# Altium schematic sheet SH10 - USB.SchDoc: Power Distribution Board Rev2 - USB
size Letter; DrawnBy: Cindy Li; Organization: UW Robotics; Address1: 200 University Avenue; Address2: Waterloo; Address3: Ontario; Address4: Canada N2L 3G6; DocumentNumber: 10; SheetNumber: 10; SheetTotal: 12
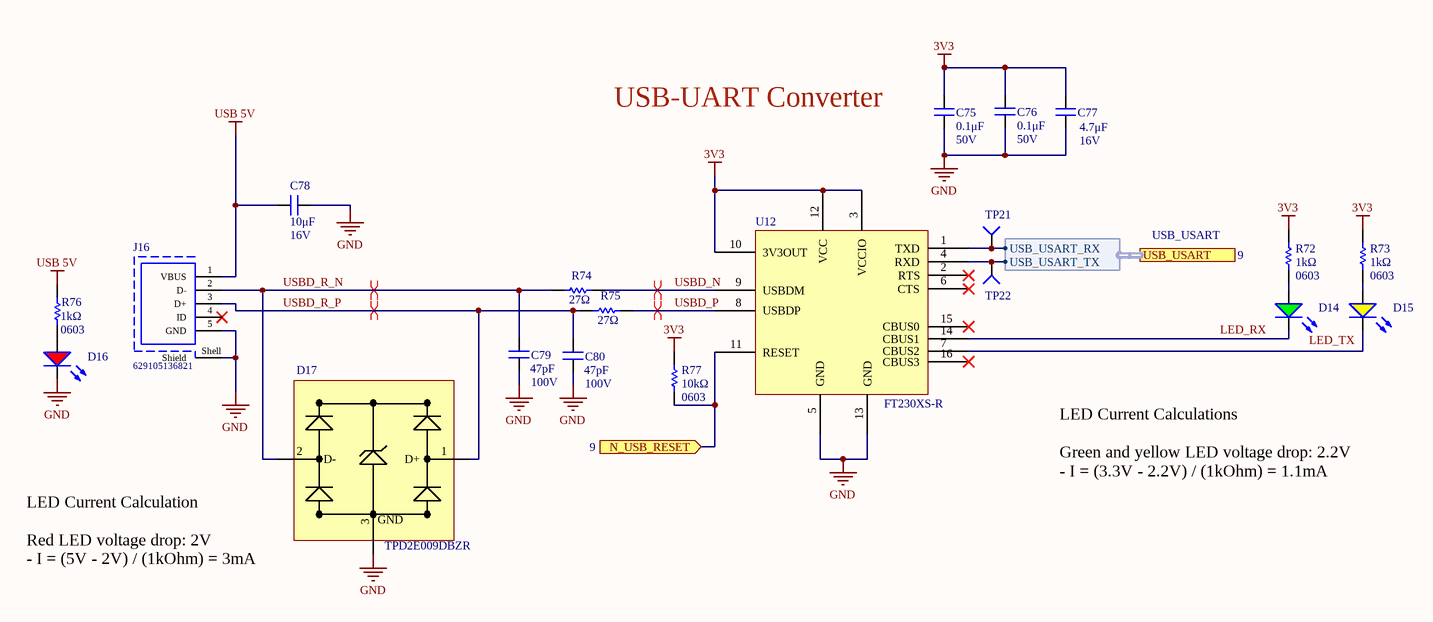
[diagram p0: SH10 - USB.SchDoc]

## Parts
C75  Voltage Rating: 50V  [CAP2012]  (hidden comment: 0.1μF)
C76  Voltage Rating: 50V  [CAP2012]  (hidden comment: 0.1μF)
C77  value 4.7μF  Voltage Rating: 16V  [CAP0603]  (hidden comment: CAP_4.7uF_16V_0603)
C78  value 10μF  Voltage Rating: 16V  [CAP0603]  (hidden comment: CAP_10nF_0603)
C79  value 47pF  Voltage Rating: 100V  [CAP0603]  (hidden comment: CAP_47pF_100V_0603)
C80  value 47pF  Voltage Rating: 100V  [CAP0603]  (hidden comment: CAP_47pF_100V_0603)
D14  LG R971-KN-1  [LED_0805_GREEN]  (value not drawn)
D15  LY R976-PS-36  [LED_0805_YELLOW]  (value not drawn)
D16  LS R976-NR-1  [LED_0805_RED]  (value not drawn)
D17  Manufacturer Part Number: TPD2E009DBZR  [SOT23-3]  (hidden comment: TVS_DIODE_USB_5.5V)
J16  629105136821  [629105136821]
R72  value 1kΩ  Case Code (Imperial): 0603  [RESC0603(1608)_N]  (hidden comment: RES_1kΩ_0603)
R73  value 1kΩ  Case Code (Imperial): 0603  [RESC0603(1608)_N]  (hidden comment: RES_1kΩ_0603)
R74  Resistance: 27Ω  [RESC0603(1608)_N]  (hidden comment: RES_27Ω_0603)
R75  Resistance: 27Ω  [RESC0603(1608)_N]  (hidden comment: RES_27Ω_0603)
R76  value 1kΩ  Case Code (Imperial): 0603  [RESC0603(1608)_N]  (hidden comment: RES_1kΩ_0603)
R77  value 10kΩ  Case Code (Imperial): 0603  [RESC0603(1608)_N]  (hidden comment: RES_10kΩ_0603)
TP21  TESTPOINT_SMD_LOOP  [S1751-46R]  (value not drawn)
TP22  TESTPOINT_SMD_LOOP  [S1751-46R]  (value not drawn)
U12  Manufacturer Part Number 1: FT230XS-R  [SSOP16-0.635-5X4MM]  (hidden comment: IC_USB_TRANSCEIVER)

## Ports
N_USB_RESET (in, see 9), USB_USART (harness USB_USART, see 9)

## Harnesses
USB_USART: USB_USART_RX, USB_USART_TX

## Nets
3V3: C75.2 C76.2 C77.1 R72.2 R73.2 R77.2 U12.3(VCCIO) U12.10(3V3OUT) U12.12(VCC)
GND: C75.1 C76.1 C77.2 C78.2 C79.1 C80.2 D16.2(K) D17.3(GND) J16.5(GND) J16.Shell(Shield) U12.5(GND) U12.13(GND)
USB 5V: C78.1 J16.1(VBUS) R76.2
N_USB_RESET: R77.1 U12.11(RESET) ; port N_USB_RESET
USBD_N: R74.2 U12.9(USBDM)
USBD_P: R75.2 U12.8(USBDP)
USBD_R_N: C79.2 D17.2(D-) J16.2(D-) R74.1
USBD_R_P: C80.1 D17.1(D+) J16.3(D+) R75.1
NetD14_1: D14.1(A) R72.1
NetD14_2: D14.2(K) U12.14(CBUS1)
NetD15_1: D15.1(A) R73.1
NetD15_2: D15.2(K) U12.7(CBUS2)
NetD16_1: D16.1(A) R76.1
NetTP21_1: TP21.1(=value) U12.1(TXD) ; port USB_USART.USB_USART_RX
NetTP22_1: TP22.1(=value) U12.4(RXD) ; port USB_USART.USB_USART_TX

Not connected (* = marked no-connect by the designer): J16 4(ID)*; U12 2(RTS)* 6(CTS)* 15(CBUS0)* 16(CBUS3)*

## Layout directives
differential pair: USBD_N, USBD_P, USBD_R_N, USBD_R_P

## Notes on the sheet
- USB-UART Converter
- LED Current Calculations
  Green and yellow LED voltage drop: 2.2V
  - I = (3.3V - 2.2V) / (1kOhm) = 1.1mA
- (near D17) LED Current Calculation
  Red LED voltage drop: 2V
  - I = (5V - 2V) / (1kOhm) = 3mA
- Labels drawn without touching a wire or pin: LED_RX, LED_TX
- Title
- Size:
- Date:
- Letter
- Drawn By:
- Sheet
- of
- File:

## Library data of the parts
C75 C76 = CAP_0.1uF_50V_0805: CAP CER 0.1UF 50V X7R 0805; Manufacturer 1: Murata Electronics; Manufacturer Part Number 1: GCD21BR71H104KA01L; Tolerance: 10%; Mount: Surface Mount; Case Code (Metric): 2012; Case Code (Imperial): 0805; Min Operating Temperature: -55°C; Max Operating Temperature: 125°C; Dielectric: X7R; Termination: SMD/SMT; Length: 2mm; Height: 1.25mm; Width: 0.049inch; Thickness: 0.049inch; Depth: 1.25mm; Ratings: AEC-Q200; Supplier 1: Digi-Key; Supplier Part Number 1: 490-11955-1-ND; Value: 0.1μF; Package: 0805 (2012 Metric)
C77 = CAP_4.7uF_16V_0603: CAP CER 4.7UF 16V X6S 0603; Manufacturer Part Number 1: GRM188C81C475KE11D; Manufacturer 1: Murata Electronics; Package: 0603 (1608 Metric); Supplier Part Number 1: 490-13362-1-ND; Supplier 1: Digi-Key; Mount: Surface Mount; Case Code (Imperial): 0603; Dielectric: X6S
C78 = CAP_10nF_0603: CAP CER 10000PF 16V X7R 0603; Manufacturer Part Number 1: CC0603KRX7R7BB103; Manufacturer 1: Yageo; Dimensions: 0.063" L x 0.031" W (1.60mm x 0.80mm); Package: 0603 (1608 Metric); Temperature Coefficient: X7R; Supplier Part Number 1: 311-3369-1-ND; Supplier 1: Digi-Key; Mount: Surface Mount; Case Code (Imperial): 0603; Case Code (Metric): 1608; Dielectric: X7R
C79 C80 = CAP_47pF_100V_0603: CAP CER 47PF 100V C0G/NP0 0603; Manufacturer Part Number 1: C0603C470J1GACTU; Manufacturer 1: KEMET; Temperature Coefficient: C0G; Dielectric: C0G, NP0; Dimensions: 0.063" L x 0.031" W (1.60mm x 0.80mm); Package: 0603 (1608 Metric); Supplier Part Number 1: 399-7917-1-ND; Supplier 1: Digi-Key; Mount: Surface Mount; Case Code (Imperial): 0603; Case Code (Metric): 1608
D14 = DIO_LED_G: LED GREEN DIFFUSED 0805 SMD; Manufacturer 1: OSRAM; Forward Voltage Drop: 2.2V; Package: 0805 (2012 Metric); Manufacturer Part Number 1: LG R971-KN-1; Supplier Part Number 1: 475-1410-1-ND; Supplier 1: Digi-Key; Mount: Surface Mount
D15 = DIO_LED_Y: LED YELLOW DIFFUSED 0805 SMD; Manufacturer 1: OSRAM; Forward Voltage Drop: 2.2V; Package: 0805 (2012 Metric); Manufacturer Part Number 1: LY R976-PS-36; Supplier Part Number 1: 475-2560-1-ND; Supplier 1: Digi-Key; Mount: Surface Mount
D16 = DIO_LED_R: LED RED DIFFUSED 0805 SMD; Manufacturer 1: OSRAM; Forward Voltage Drop: 2V; Package: 0805 (2012 Metric); Manufacturer Part Number 1: LS R976-NR-1; Supplier Part Number 1: 475-1278-1-ND; Supplier 1: Digi-Key; Mount: Surface Mount
D17 = TVS_DIODE_USB_5.5V: TVS DIODE 5.5V 8V SOT23-3; Manufacturer: Texas Instruments; Direction: Unidirectional; Operating Supply Voltage: 6V; Capacitance: 0.9pF; Number of Channels: 2; Current Rating: 100nA; Peak Pulse Current: 1A; Element Configuration: Dual; Min Breakdown Voltage: 9V; Peak Pulse Power: 45W; Power Line Protection: Yes; Breakdown Voltage: 7V; Interface: LVDS,PCIe,SATA; Supplier 1: Digi-Key; Category: Interface ICs; Case/Package: SOT-23; Number of Pins: 3; Min Operating Temperature: -40°C; Max Operating Temperature: 85°C; Number of Bidirectional Channels: 2; Reverse Standoff Voltage: 5.5V; Clamping Voltage: 8V; Termination: SMD/SMT; Max Power Dissipation: 45W; Working Voltage: 5.5V; Length: 2.92mm; Height: 1mm; Width: 1.3mm; Depth: 1.3mm; REACH SVHC: No SVHC; Supplier Part Number 1: 296-24657-1-ND
J16 = WE 629105136821: CONN RCPT USB2.0 MICRO B SMD R/A; Manufacturer: Wurth Elektronik; Contact Resistance: 30mOhm; Rated Current: 1A; Working Voltage: 30VAC; Connector Type: MicroUSB2.0TypeB; Gender: Receptacle; Datasheet URL: https://katalog.we-online.de/em/datasheet/629105136821.pdf; Mounting Technology: SMT; Publisher: WurthElektronik; Package Reference: 629105136821; Orientation: Horizontal; Part Number: 629105136821; Manufacturer URL: http://www.we-online.de; Operating Temperature: -40to105degC
R72 R73 R76 = RES_1kΩ_0603_5%: RES 1K OHM 5% 1/10W 0603; Manufacturer 1: Yageo; Manufacturer Part Number 1: RC0603JR-071KL; Dimensions: 0.063" L x 0.031" W (1.60mm x 0.80mm); Tolerance: 5%; Package: 0603 (1608 Metric); Supplier Part Number 1: 311-1.0KGRCT-ND; Supplier 1: Digi-Key; Mount: Surface Mount; Case Code (Metric): 1608
R74 R75 = RES_27Ω_0603_5%: RES 27 OHM 5% 1/10W 0603; Manufacturer: Yageo; Manufacturer Part Number 1: RC0603JR-0727RL; Voltage Rating (DC): 50V; Power Rating: 100mW; Temperature Coefficient: 100ppm/°C; Value: 27Ω; Supplier 1: Digi-Key; Category: Chip SMD Resistors; Number of Pins: 2; Case Code (Imperial): 0603; Case Code (Metric): 1608; Min Operating Temperature: -55°C; Max Operating Temperature: 155°C; Tolerance: 5%; Voltage Rating: 50V; Termination: SMD/SMT; Composition: Thick Film; Military Standard: Not; Length: 1.6mm; Width: 0.8mm; Depth: 0.8mm; REACH SVHC: No SVHC; Supplier Part Number 1: 311-27GRCT-ND; Dimensions: 0.063" L x 0.031" W (1.60mm x 0.80mm); Mount: Surface Mount; Package: 0603 (1608 Metric)
R77 = RES_10kΩ_0603_5%: RES 10K OHM 5% 1/10W 0603; Manufacturer 1: Yageo; Manufacturer Part Number 1: RC0603JR-0710KL; Package: 0603 (1608 Metric); Dimensions: 0.063" L x 0.031" W (1.60mm x 0.80mm); Tolerance: 5%; Supplier Part Number 1: 311-10KGRCT-ND; Supplier 1: Digi-Key; Mount: Surface Mount; Case Code (Metric): 1608
TP21 TP22 = TESTPOINT_SMD_LOOP: PC TEST POINT SMD; Manufacturer 1: Harwin; Plating: Tin; Number of Ports: 1; Supplier 1: Digi-Key; Manufacturer Part Number 1: S1751-46R; RoHS: Yes; Category: Terminal Blocks; Stock 1: 159143; Pricing 1: 1=0.29000, 10=0.27700, 25=0.23760, 50=0.20200, 100=0.19400, 250=0.17424, 500=0.16632, 1000=0.13860 (USD); Mount: Surface Mount; Material: Brass,Copper Alloy; Contact Material: Copper,Copper Alloy; Contact Plating: Tin; Color: Natural; Termination: Solder; Orientation: Straight; Number of Contacts: 1; Package Quantity: 2500; Packaging: Tape and Reel; Length: 3.25mm; Height: 2mm; Depth: 2mm; Width: 1.65mm; Radiation Hardening: No; REACH SVHC: No SVHC; ComponentLink1URL: https://datasheet.ciiva.com:443/pdfs/VipMasterIC/IC/HRWN/HRWN-S-A0002541722/HRWN-S-A0004513972-1.pdf?src-supplier=IHS+Markit; ComponentLink1Description: https://datasheet.ciiva.com:443/pdfs/VipMasterIC/IC/HRWN/HRWN-S-A0002541722/HRWN-S-A0004513972-1.pdf?src-supplier=IHS+Markit; ComponentLink2URL: https://datasheet.ciiva.com/5224/2010page161-58228-5224784.pdf?src-supplier=Mouser; ComponentLink2Description: https://datasheet.ciiva.com/5224/2010page161-58228-5224784.pdf?src-supplier=Mouser; ComponentLink3URL: https://datasheet.ciiva.com/22631/1688119-22631153.pdf?src-supplier=Element14; ComponentLink3Description: https://datasheet.ciiva.com/22631/1688119-22631153.pdf?src-supplier=Element14; ComponentLink4URL: https://datasheet.ciiva.com/2917/s1751-2917604.pdf?src-supplier=Digi-Key; ComponentLink4Description: https://datasheet.ciiva.com/2917/s1751-2917604.pdf?src-supplier=Digi-Key; ComponentLink5URL: https://datasheet.ciiva.com/1462/1693781-1462652.pdf?src-supplier=Farnell; ComponentLink5Description: https://datasheet.ciiva.com/1462/1693781-1462652.pdf?src-supplier=Farnell; ComponentLink6URL: https://datasheet.ciiva.com/1454/1693781-1454941.pdf?src-supplier=Element14; ComponentLink6Description: https://datasheet.ciiva.com/1454/1693781-1454941.pdf?src-supplier=Element14; Supplier Part Number 1: 952-1478-1-ND
U12 = IC_USB_TRANSCEIVER: IC USB SERIAL BASIC UART 16SSOP; Manufacturer 1: FTDI, Future Technology Devices International Ltd; Supplier 1: Digi-Key; Supplier Part Number 1: 768-1135-1-ND